# Altium schematic sheet Hall.SchDoc
size 594 x 420 mm; Address1: Address1; Address2: Address2; Address3: Address3; Address4: Address4; SheetNumber: 1; Scale: 1:1; Разраб.: Иванов; Обозначение документа: АБВГ.123456.001 Э3; Пров.: Петров; Утв.: Сидоров; Наименование организации: ОАО "Концерн "МПО-Гидроприбор"; Перв. применение: АБВГ.123456.000; Наименование изделия 1: Плата; Наименование изделия 2: Схема электрическая; Наименование изделия 3: принципиальная; Нач. отд.: Нач. отд.; Фамилия нач. отд.: Сидоров
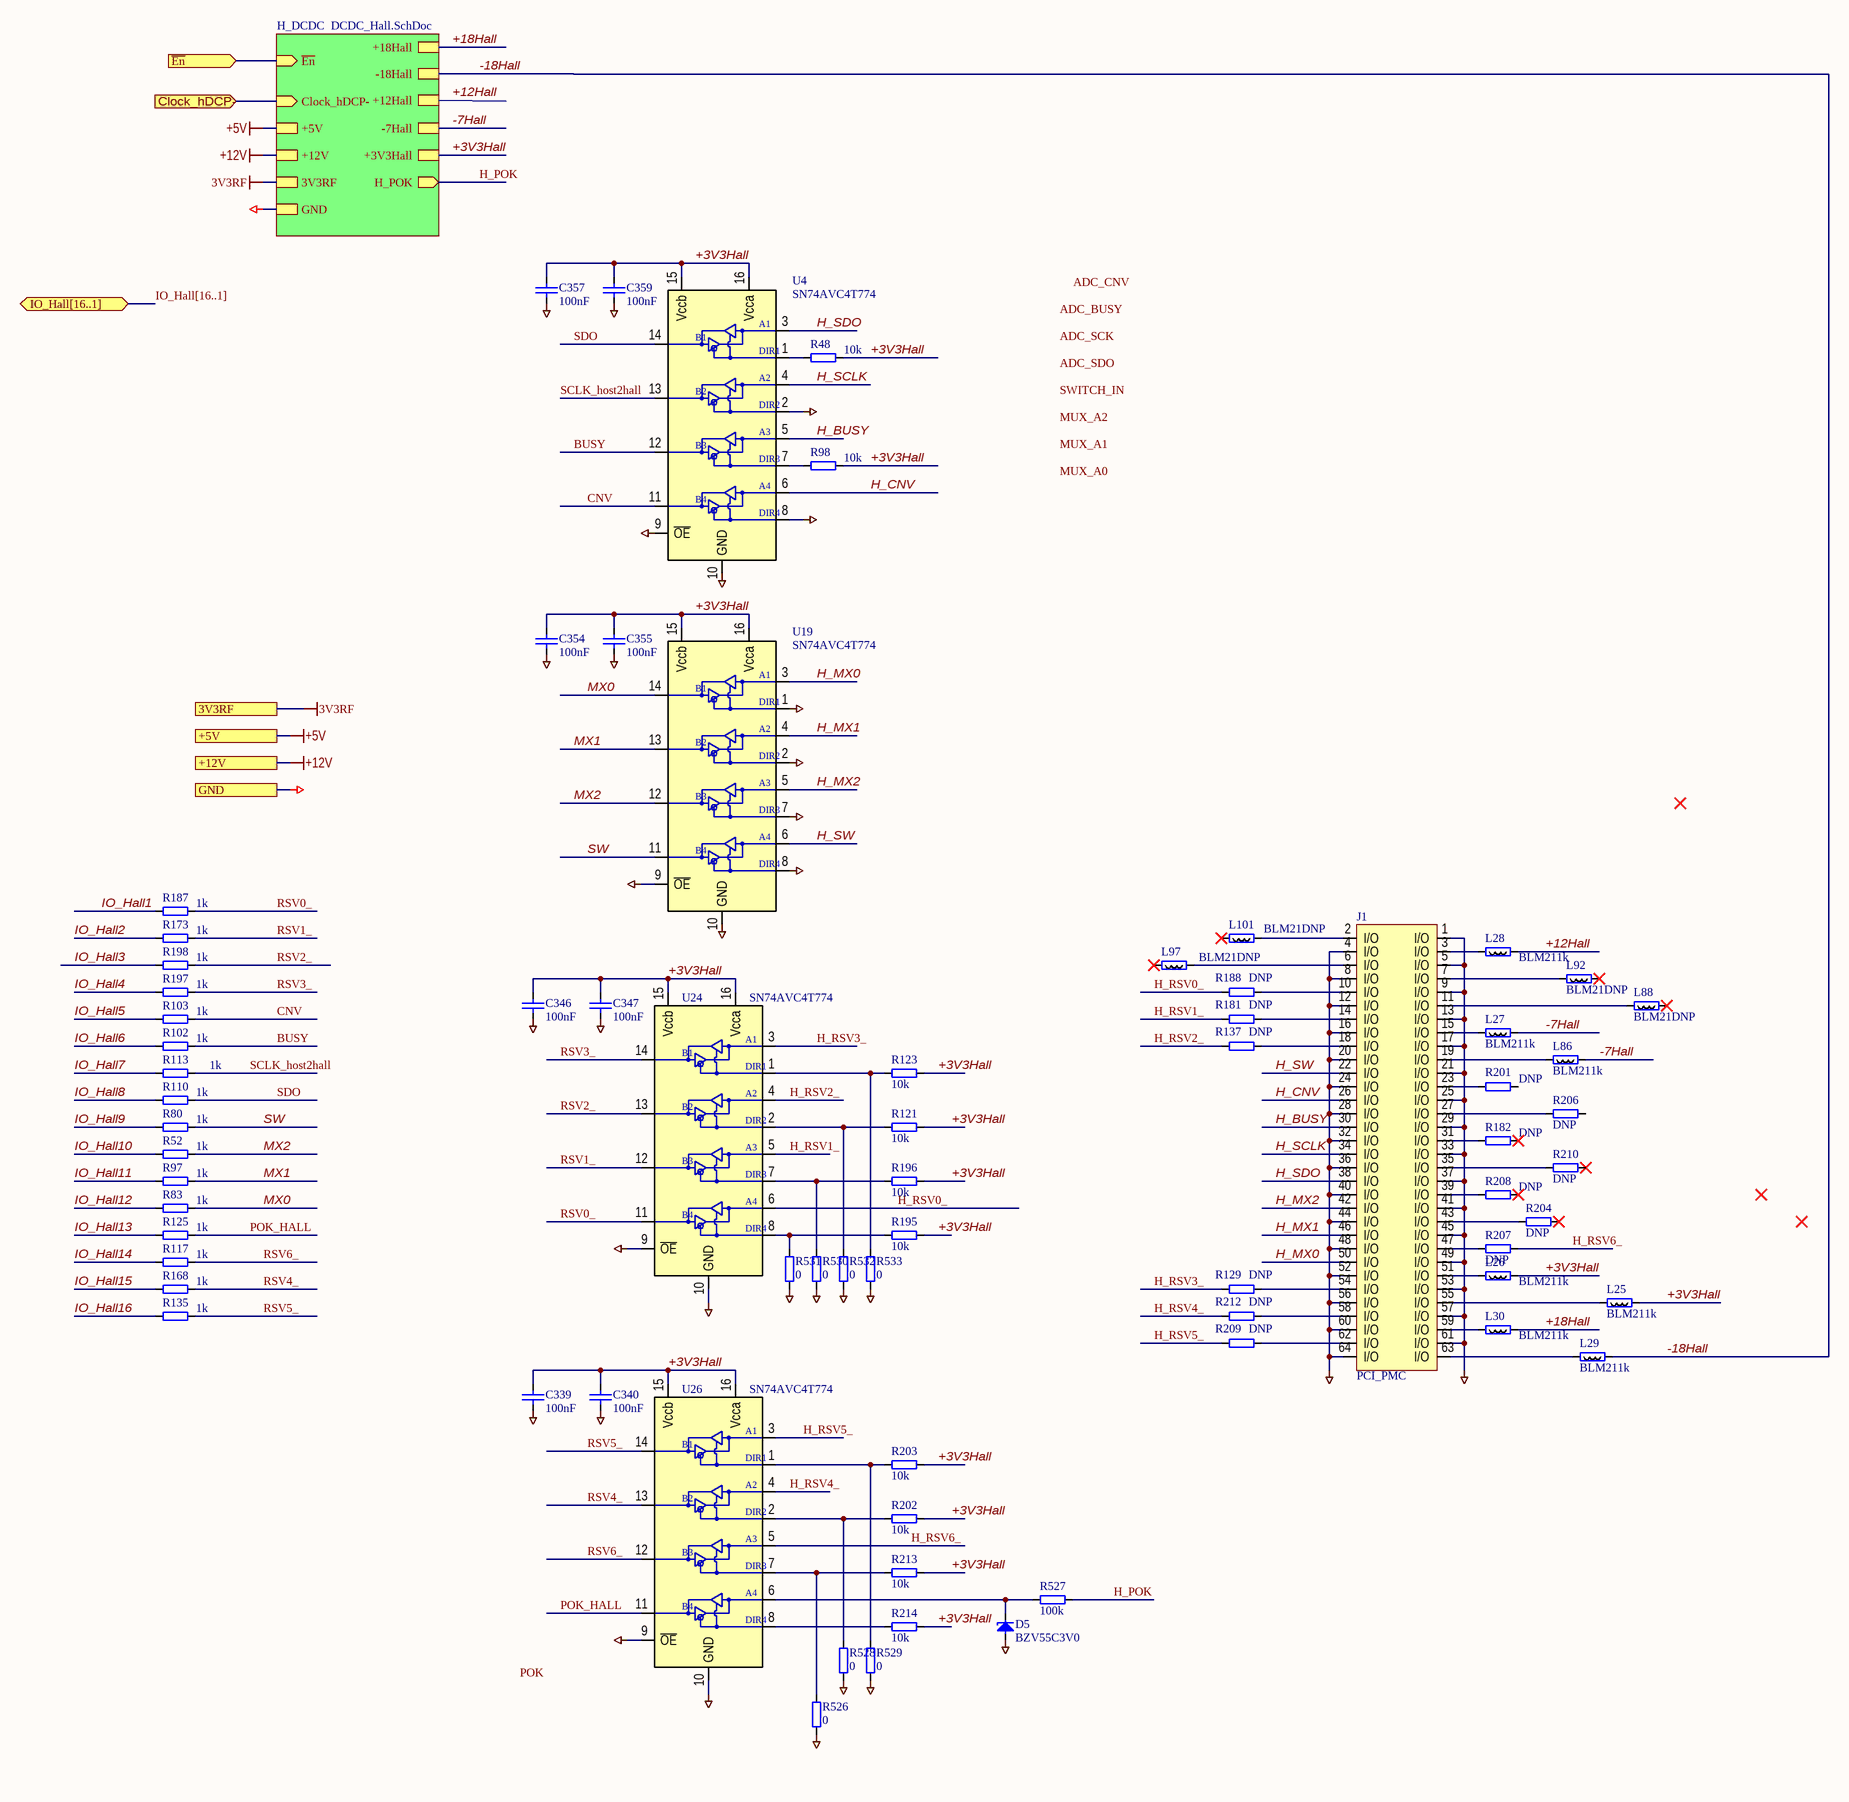
[diagram p0: Hall.SchDoc]

## Parts
C339  100nF  [SMD0805CAP]
C340  100nF  [SMD0805CAP]
C346  100nF  [SMD0805CAP]
C347  100nF  [SMD0805CAP]
C354  100nF  [SMD0805CAP]
C355  100nF  [SMD0805CAP]
C357  100nF  [SMD0805CAP]
C359  100nF  [SMD0805CAP]
D5  BZV55C3V0  [DIOMELF3516N]
J1  PCI_PMC  [TYCO_120521-1]
L25  BLM211k  [RESC2012X50N]
L26  BLM211k  [RESC2012X50N]
L27  BLM211k  [RESC2012X50N]
L28  BLM211k  [RESC2012X50N]
L29  BLM211k  [RESC2012X50N]
L30  BLM211k  [RESC2012X50N]
L86  BLM211k  [RESC2012X50N]
L88  BLM21DNP  [RESC2012X50N]
L92  BLM21DNP  [RESC2012X50N]
L97  BLM21DNP  [RESC2012X50N]
L101  BLM21DNP  [RESC2012X50N]
R48  10k  [SMD0805RES]
R52  1k  [SMD0805RES]
R80  1k  [SMD0805RES]
R83  1k  [SMD0805RES]
R97  1k  [SMD0805RES]
R98  10k  [SMD0805RES]
R102  1k  [SMD0805RES]
R103  1k  [SMD0805RES]
R110  1k  [SMD0805RES]
R113  1k  [SMD0805RES]
R117  1k  [SMD0805RES]
R121  10k  [SMD0805RES]
R123  10k  [SMD0805RES]
R125  1k  [SMD0805RES]
R129  DNP  [SMD0805RES]
R135  1k  [SMD0805RES]
R137  DNP  [SMD0805RES]
R168  1k  [SMD0805RES]
R173  1k  [SMD0805RES]
R181  DNP  [SMD0805RES]
R182  DNP  [SMD0805RES]
R187  1k  [SMD0805RES]
R188  DNP  [SMD0805RES]
R195  10k  [SMD0805RES]
R196  10k  [SMD0805RES]
R197  1k  [SMD0805RES]
R198  1k  [SMD0805RES]
R201  DNP  [SMD0805RES]
R202  10k  [SMD0805RES]
R203  10k  [SMD0805RES]
R204  DNP  [SMD0805RES]
R206  DNP  [SMD0805RES]
R207  DNP  [SMD0805RES]
R208  DNP  [SMD0805RES]
R209  DNP  [SMD0805RES]
R210  DNP  [SMD0805RES]
R212  DNP  [SMD0805RES]
R213  10k  [SMD0805RES]
R214  10k  [SMD0805RES]
R526  0  [SMD0805RES]
R527  100k  [SMD0805RES]
R528  0  [SMD0805RES]
R529  0  [SMD0805RES]
R530  0  [SMD0805RES]
R531  0  [SMD0805RES]
R532  0  [SMD0805RES]
R533  0  [SMD0805RES]
U4  SN74AVC4T774  [TSSOP-16]
U19  SN74AVC4T774  [TSSOP-16]
U24  SN74AVC4T774  [TSSOP-16]
U26  SN74AVC4T774  [TSSOP-16]

## Sub-sheets
H_DCDC = DCDC_Hall.SchDoc: +18Hall, -18Hall, +12Hall, -7Hall, +3V3Hall, ~{En} (in), Clock_hDCP- (in), GND, +12V, +5V, 3V3RF, H_POK (out)

## Ports
3V3RF, +5V, +12V, Clock_hDCP- (in), GND, IO_Hall[16..1] (bidir), ~{En} (in)

## Nets
3V3RF: port 3V3RF, sheet H_DCDC/3V3RF
+5V: port +5V, sheet H_DCDC/+5V
+12V: port +12V, sheet H_DCDC/+12V
GND: C339.1 C340.1 C346.1 C347.1 C354.1 C355.1 C357.1 C359.1 D5.2(A) J1.1(I/O) J1.4(I/O) J1.5(I/O) J1.8(I/O) J1.9(I/O) J1.12(I/O) J1.13(I/O) J1.16(I/O) J1.17(I/O) J1.20(I/O) J1.21(I/O) J1.24(I/O) J1.25(I/O) J1.28(I/O) J1.29(I/O) J1.32(I/O) J1.33(I/O) J1.36(I/O) J1.37(I/O) J1.40(I/O) J1.41(I/O) J1.44(I/O) J1.45(I/O) J1.48(I/O) J1.49(I/O) J1.52(I/O) J1.53(I/O) J1.56(I/O) J1.57(I/O) J1.60(I/O) J1.61(I/O) J1.64(I/O) R526.1 R528.1 R529.1 R530.1 R531.1 R532.1 R533.1 U4.2(DIR2) U4.8(DIR4) U4.9(~{OE}) U4.10(GND) U19.1(DIR1) U19.2(DIR2) U19.7(DIR3) U19.8(DIR4) U19.9(~{OE}) U19.10(GND) U24.9(~{OE}) U24.10(GND) U26.9(~{OE}) U26.10(GND) ; port GND, sheet H_DCDC/GND
+3V3Hall: C339.2 C340.2 C346.2 C347.2 C354.2 C355.2 C357.2 C359.2 L25.2 L26.2 R48.1 R98.1 R121.2 R123.2 R195.2 R196.2 R202.2 R203.2 R213.2 R214.2 U4.15(Vccb) U4.16(Vcca) U19.15(Vccb) U19.16(Vcca) U24.15(Vccb) U24.16(Vcca) U26.15(Vccb) U26.16(Vcca) ; sheet H_DCDC/+3V3Hall
+12Hall: L28.2 ; sheet H_DCDC/+12Hall
+18Hall: L30.2 ; sheet H_DCDC/+18Hall
-7Hall: L27.2 L86.2 ; sheet H_DCDC/-7Hall
-18Hall: L29.2 ; sheet H_DCDC/-18Hall
~{En}: port ~{En}, sheet H_DCDC/~{En}
BUSY: R102.1 U4.12(B3)
Clock_hDCP-: port Clock_hDCP-, sheet H_DCDC/Clock_hDCP-
CNV: R103.1 U4.11(B4)
H_BUSY: J1.30(I/O) U4.5(A3)
H_CNV: J1.26(I/O) U4.6(A4)
H_MX0: J1.50(I/O) U19.3(A1)
H_MX1: J1.46(I/O) U19.4(A2)
H_MX2: J1.42(I/O) U19.5(A3)
H_POK: R527.1 ; sheet H_DCDC/H_POK
H_RSV0_: R188.2 U24.6(A4)
H_RSV1_: R181.2 U24.5(A3)
H_RSV2_: R137.2 U24.4(A2)
H_RSV3_: R129.2 U24.3(A1)
H_RSV4_: R212.2 U26.4(A2)
H_RSV5_: R209.2 U26.3(A1)
H_RSV6_: R207.2 U26.5(A3)
H_SCLK: J1.34(I/O) U4.4(A2)
H_SDO: J1.38(I/O) U4.3(A1)
H_SW: J1.22(I/O) U19.6(A4)
IO_Hall1: R187.2
IO_Hall2: R173.2
IO_Hall3: R198.2
IO_Hall4: R197.2
IO_Hall5: R103.2
IO_Hall6: R102.2
IO_Hall7: R113.2
IO_Hall8: R110.2
IO_Hall9: R80.2
IO_Hall10: R52.2
IO_Hall11: R97.2
IO_Hall12: R83.2
IO_Hall13: R125.2
IO_Hall14: R117.2
IO_Hall15: R168.2
IO_Hall16: R135.2
MX0: R83.1 U19.14(B1)
MX1: R97.1 U19.13(B2)
MX2: R52.1 U19.12(B3)
POK_HALL: R125.1 U26.11(B4)
RSV0_: R187.1 U24.11(B4)
RSV1_: R173.1 U24.12(B3)
RSV2_: R198.1 U24.13(B2)
RSV3_: R197.1 U24.14(B1)
RSV4_: R168.1 U26.13(B2)
RSV5_: R135.1 U26.14(B1)
RSV6_: R117.1 U26.12(B3)
SCLK_host2hall: R113.1 U4.13(B2)
SDO: R110.1 U4.14(B1)
SW: R80.1 U19.11(B4)
NetD5_1: D5.1(C) R527.2 U26.6(A4)
NetJ1_2: J1.2(I/O) L101.2
NetJ1_3: J1.3(I/O) L28.1
NetJ1_6: J1.6(I/O) L97.2
NetJ1_7: J1.7(I/O) L92.1
NetJ1_10: J1.10(I/O) R188.1
NetJ1_11: J1.11(I/O) L88.1
NetJ1_14: J1.14(I/O) R181.1
NetJ1_15: J1.15(I/O) L27.1
NetJ1_18: J1.18(I/O) R137.1
NetJ1_19: J1.19(I/O) L86.1
NetJ1_23: J1.23(I/O) R201.2
NetJ1_27: J1.27(I/O) R206.1
NetJ1_31: J1.31(I/O) R182.2
NetJ1_35: J1.35(I/O) R210.1
NetJ1_39: J1.39(I/O) R208.2
NetJ1_43: J1.43(I/O) R204.1
NetJ1_47: J1.47(I/O) R207.1
NetJ1_51: J1.51(I/O) L26.1
NetJ1_54: J1.54(I/O) R129.1
NetJ1_55: J1.55(I/O) L25.1
NetJ1_58: J1.58(I/O) R212.1
NetJ1_59: J1.59(I/O) L30.1
NetJ1_62: J1.62(I/O) R209.1
NetJ1_63: J1.63(I/O) L29.1
NetR48_2: R48.2 U4.1(DIR1)
NetR98_2: R98.2 U4.7(DIR3)
NetR121_1: R121.1 R532.2 U24.2(DIR2)
NetR123_1: R123.1 R533.2 U24.1(DIR1)
NetR195_1: R195.1 R531.2 U24.8(DIR4)
NetR196_1: R196.1 R530.2 U24.7(DIR3)
NetR202_1: R202.1 R528.2 U26.2(DIR2)
NetR203_1: R203.1 R529.2 U26.1(DIR1)
NetR213_1: R213.1 R526.2 U26.7(DIR3)
NetR214_1: R214.1 U26.8(DIR4)

Not connected (* = marked no-connect by the designer): L88 2*; L92 2*; L97 1*; L101 1*; R182 1*; R201 1; R204 2*; R206 2; R208 1*; R210 2*

## Buses and harness runs
bus IO_Hall[16..1] = port IO_Hall[16..1]

## Notes on the sheet
- Labels drawn without touching a wire or pin: ADC_BUSY, ADC_CNV, ADC_SCK, ADC_SDO, MUX_A0, MUX_A1, MUX_A2, POK, SWITCH_IN
- Подп. и дата
- Инв. № дубл.
- Взам. инв. №
- Инв. № подл.
- Изм.
- Лист
- № докум.
- Подп.
- Дата
- Копировал
- Формат А2

## Library data of the parts
C339 C340 C346 C347 C354 C355 C357 C359 = C0805: Чип конденсатор 0805; Voltage: 25V; Vendor: Vishay; DielectricType: X5R; SMD Solders: 2; Solder Option: RM; Tolerance: 20%; Pkg: SMD0805; Device: Cap0805; Value: 100nF; Price: 2
D5 = BZV55C: Чип cтабилитрон; Vendor: LGE; Value: 3V0; Voltage: 3V; SMD Solders: 2; Solder Option: RM; Pkg: SOD80; Current: 5; Price: 5; Device: BZV55C; Name to order: BZV55C3V0
J1 = PCI_PMC_M: PCI Mezzanine Connector; IEEE 1386 MainBoard; Manufactuer: TE Connectivity; PartField: 120527-1; SolderOption: 2; Pkg: PMC Male (IEEE 1386); Value: PCI_PMC; Vendor: TE Connectivity
L25-L30 L86 = BLM21: SMD Ferrite bead 0805; Vendor: Vishay; Value: 1k; Pkg: SMD0805; SMD Solders: 2; Solder Option: RM; Price: 10; Device: BLM21
L88 L92 L97 L101 = BLM21: SMD Ferrite bead 0805; Vendor: Vishay; Value: DNP; Pkg: SMD0805; SMD Solders: 2; Solder Option: RM; Price: 10; Device: BLM21
R48 R52 R80 R83 R97 R98 R102 R103 R110 R117 R125 R129 R135 R137 R168 R173 R181 R182 R187 R188 R197 R198 R201 R204 R207-R209 R212 = R0805: Чип резистор 0805; Vendor: Vishay; SMD Solders: 2; Solder Option: i; TC: 100ppm/C; Tolerance: 1%; Pkg: SMD0805; Pwr: 125mW; Device: Res0805; Price: 2
  R48 R98: Value: 10k
  R52 R80 R83 R97 R102 R103 R110 R117 R125 R135 R168 R173 R187 R197 R198: Value: 1k
  R129 R137 R181 R182 R188 R201 R204 R207-R209 R212: Value: DNP
R113 R121 R123 R195 R196 R202 R203 R206 R210 R213 R214 R526-R533 = R0805: Чип резистор 0805; Vendor: Vishay; SMD Solders: 2; Solder Option: RM; TC: 100ppm/C; Tolerance: 1%; Pkg: SMD0805; Pwr: 125mW; Device: Res0805; Price: 2
  R113: Value: 1k
  R121 R123 R195 R196 R202 R203 R213 R214: Value: 10k
  R206 R210: Value: DNP
  R526 R528-R533: Value: 0
  R527: Value: 100k
U4 U19 U24 U26 = SN74AVC4T774: Двунаправленный буфер; Pkg: TSSOP16; SMD Solders: 16; Solder Option: RM; THD Solders: 0; Vendor: Texas Instruments; Voltage: 1V1.. 3.6V  I/Os are 4.6-V Tolerant; Name to order: SN74AVC4T774PW; Device: SN74AVC4T774; Price: 300